# EAGLE design beast_navi_small_ic (EAGLE 9.6.2)
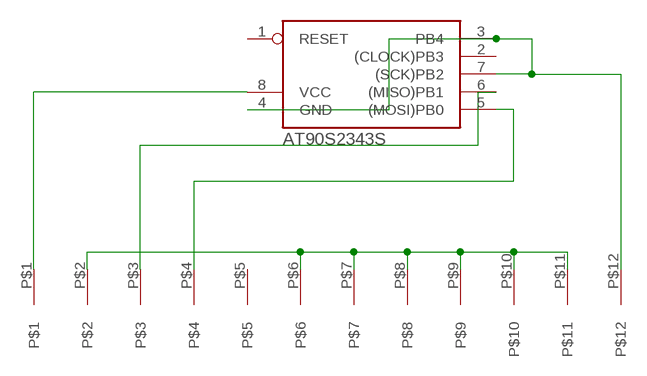
[diagram p0: schematic, sheet 1]

## Parts
IC1  AT90S2343S  [SOIC8]
U$1  BEAST  [BEAST]

## Nets
N$1: U$1.P$2 U$1.P$6 U$1.P$7 U$1.P$8 U$1.P$9 U$1.P$10 U$1.P$11
N$2: IC1.3(PB4) IC1.4(GND) IC1.7((SCK)PB2) U$1.P$12
N$5: IC1.6((MISO)PB1) U$1.P$3
N$14: IC1.8(VCC) U$1.P$1
N$15: IC1.5((MOSI)PB0) U$1.P$4
Unconnected: IC1.1(RESET) IC1.2((CLOCK)PB3) U$1.P$5

## Library data of the parts
IC1 = atmel:AT90*2343: MICROCONTROLLER 2 Kbytes FLASH 128 bytes SRAM 128 bytes EEPROM; OC_FARNELL: unknown; OC_NEWARK: unknown
U$1 = beastpins:BEAST

## Board
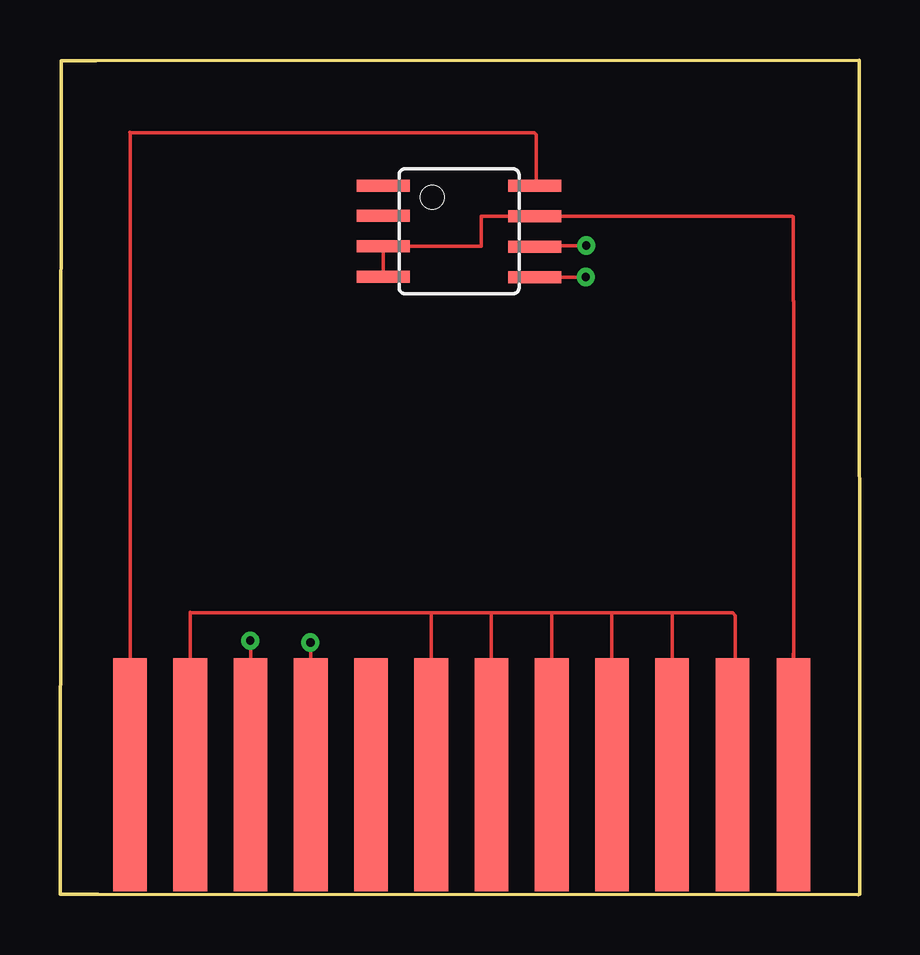
[diagram p1: board, top side]
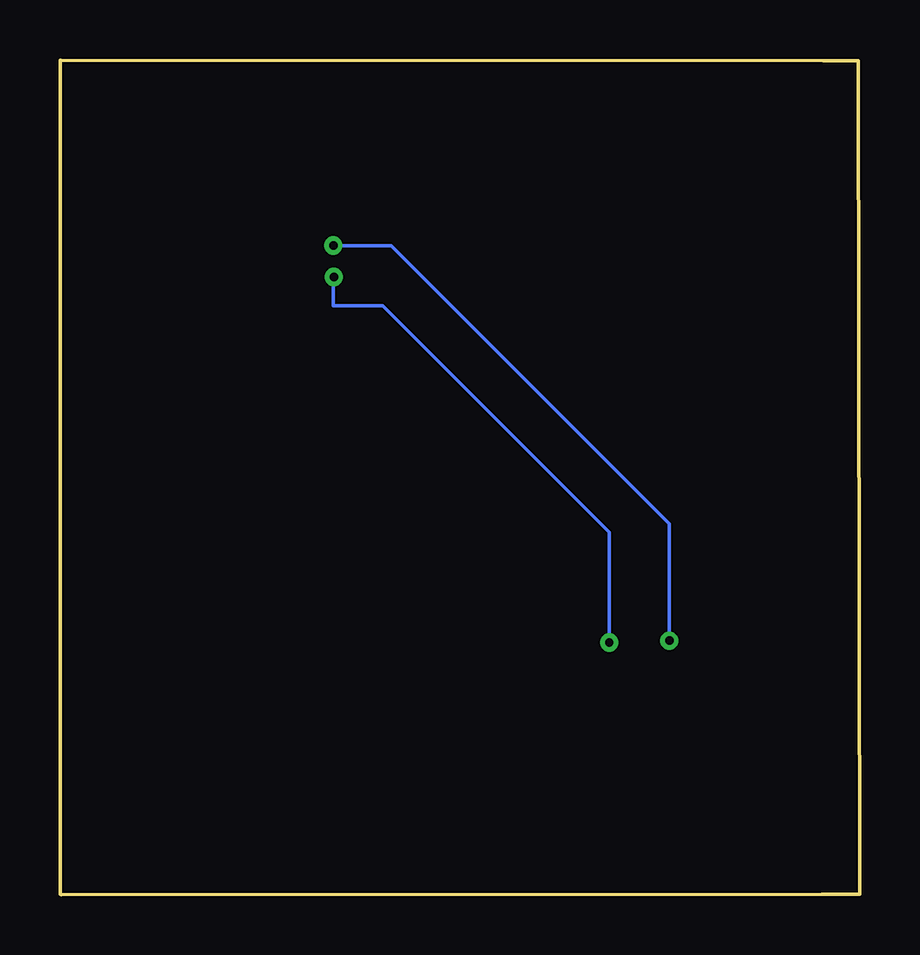
[diagram p2: board, bottom side, seen from below]

Size 33.32 x 34.79 mm. Coordinates in mm from the lower left corner, seen from the top.
Outline: 1.55,0.02 33.27,0
Outline: 0,0.04 0.05,34.73
Outline: 33.32,0.04 33.3,34.79
Outline: 1.51,34.76 33.3,34.77
Outline: 0.05,34.76 1.49,34.76
Outline: 0,0.02 1.59,0.02
Copper layers (1*16): Top 0.035mm / dielectric 1.5mm / Bottom 0.035mm
Design rules "default *": minimum track width 6mil, minimum drill 0.35mm, track to track 1mil, track to pad 6mil, pad to pad 6mil, via to via 6mil, smd to smd 6mil, copper to edge 0.002540625mm, drill to drill 1mil, minimum pad ring 10mil, minimum via ring 8mil, stop-mask expansion 4mil, vias tented up to drill 0mil, thermal gap 10mil

### Footprints (pad centres in the part's own frame; a part is rotated, then mirrored left to right if it is on the bottom)
SOIC8 = smd 0.5 x 2.2: 1 -1.905,-3.154; 2 -0.645,-3.154; 3 0.625,-3.154; 4 1.895,-3.154; 5 1.905,3.154; 6 0.635,3.154; 7 -0.635,3.154; 8 -1.905,3.154
BEAST = smd 1.4 x 9.7: P$1 -27.61,5.02; P$2 -25.1,5.02; P$3 -22.59,5.02; P$4 -20.08,5.02; P$5 -17.57,5.02; P$6 -15.06,5.02; P$7 -12.55,5.02; P$8 -10.04,5.02; P$9 -7.53,5.02; P$10 -5.02,5.02; P$11 -2.51,5.02; P$12 0.03,5.02

### Placement (x,y rotation side)
IC1  16.63,27.65 270 top
U$1  30.53,-0.02 0 top

### Tracks (layer width: path | path; a pad name or v marks a point on that pad's centre or on a via)
N$1
  Top 0.152: 28.13,9.59 28.13,9.23 | U$1.P$11 28.02,9.48 28.13,9.59 | 5.42,11.78 5.43,11.77 | U$1.P$2 5.43,11.77 | 5.43,11.77 5.45,11.75 15.45,11.75 | 15.45,11.75 17.98,11.75 | 17.98,11.75 20.44,11.75 | 20.44,11.75 22.95,11.75 | 22.95,11.75 25.48,11.75 | 25.48,11.75 28.02,11.75 28.13,11.64 28.13,9.59 | U$1.P$6 15.47,11.73 15.45,11.75 | U$1.P$7 17.98,11.74 17.98,11.75 | U$1.P$8 20.49,11.7 20.44,11.75 | U$1.P$9 23,11.7 22.95,11.75 | U$1.P$10 25.51,11.72 25.48,11.75
N$2
  Top 0.152: IC1.4 IC1.3 | IC1.3 13.7,27.03 | 30.58,10.06 30.58,24.73 30.54,24.77 30.55,24.77 30.55,28.25 30.51,28.29 IC1.7 17.55,28.28 17.55,27.04 17.54,27.03 | 30.58,10.06 30.58,9.68 30.36,9.46 | IC1.3 17.54,27.03 | 17.54,27.03 17.54,27.02 | 30.56,5.14 U$1.P$12 30.56,10.04 30.58,10.06
N$5  (via drill 0.35)
  Top 0.152: v21.93,27.06 19.78,27.06 IC1.6 | U$1.P$3 v7.94,10.58 v7.93,10.6
  Bottom 0.152: v21.93,27.06 19.51,27.06 7.93,15.47 v7.93,10.6
N$14
  Top 0.152: IC1.8 19.83,29.61 19.83,31.68 19.76,31.75 2.93,31.75 2.92,31.76 | 2.91,31.77 2.92,31.76 | U$1.P$1 2.92,10.85 2.92,12.46 2.92,31.76
N$15  (via drill 0.35)
  Top 0.152: U$1.P$4 10.45,10.5 v10.43,10.51 | v21.9,25.75 | IC1.5 v21.9,25.75
  Bottom 0.152: v21.9,25.75 21.87,25.74 21.93,25.69 21.93,24.55 19.87,24.55 10.43,15.11 v10.43,10.51